# Altium schematic sheet 06_PWR_Inputs_12V.SchDoc
size 209 x 297 mm; DocumentNumber: Питание входов; SheetNumber: 7; SheetTotal: 11
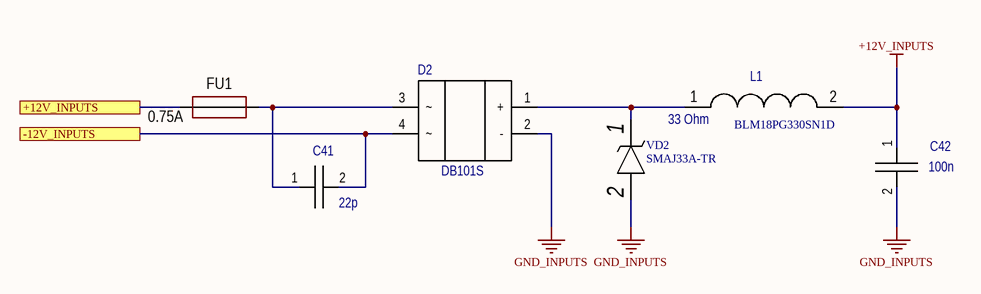
[diagram p0: 06_PWR_Inputs_12V.SchDoc]

## Parts
C41  value 22p  [C0603]  (hidden comment: C0603)
C42  value 100n  [C0603]  (hidden comment: C0603)
D2  DB101S  [DB-1S]
FU1  MaxCurrent: 0.75A  [FUSE: 1206]
L1  BLM18PG330SN1D  value 33 Ohm  [INDC1608N]
VD2  SMAJ33A-TR  [SM4T82AY]

## Ports
+12V_INPUTS, -12V_INPUTS

## Nets
+12V_INPUTS: C42.1 L1.2
GND_INPUTS: C42.2 D2.2(-) VD2.2(A)
+12V_INPUTS: FU1.1 ; port +12V_INPUTS  [a separate net that carries the same name]
-12V_INPUTS: C41.2 D2.4 ; port -12V_INPUTS
NetC41_1: C41.1 D2.3 FU1.2
NetD2_1: D2.1(+) L1.1 VD2.1(K)

## Notes on the sheet
- Подп. и дата
- Инв. № дубл.
- Взам. инв. №
- Инв. № подл.
- Изм.
- Лист
- № докум.
- Подп.
- Дата
- Форма 2а ГОСТ 2.104-2006
- Копировал
- Формат А4

## Library data of the parts
C41 = GRM1885C1H220JA01D: Manufacturer: Murata Manufacturing; Код: 80; ID: Конденсатор; Power/Voltage: 50V; Tolerance: ±5%; TKE: c0g; iii: Конденсатор GRM1885C1H220JA01D 22p 50V ±5% C0603 c0g Murata Manufacturing; Comments: C0603; Part Number: GRM1885C1H220JA01D; Package: C0603; TemperatureMin: -55; TemperatureMax: 125
C42 = GRM188R71E104KA01D: Manufacturer: Murata Manufacturing; Код: 23; ID: Конденсатор; Power/Voltage: 25V; Tolerance: ±10%; TKE: X7R; iii: Конденсатор GRM188R71E104KA01D 100n 25V ±10% C0603 X7R  Murata Manufacturing; Comments: C0603; Part Number: GRM188R71E104KA01D; Height: 0.9; Package: C0603; TemperatureMin: -55; TemperatureMax: 125
D2 = DB101S: SINGLE-PHASE SURFACE MOUNT BRIDGE RECTIFIER; Manufacturer: DC COMPONENTS; Код: 5; ID: Диодный мост; Value: 1A; Power/Voltage: 50V; iii: Диодный мост DB101S 1A 50V    DC COMPONENTS; Com: DB101S; Part Number: DB101S; ComponentLink1Description: Datasheet; ComponentLink1URL: \\server_altium\ServerShare\Schematic\pdf\DB101S.pdf; TemperatureMin: -55; TemperatureMax: 150
FU1 = Fuse: Manufacturer: 1206-13V-075A-1; VoltageMax: 13; Package: 1206; ValueManufacturerPartNumber: =TypeFuse+', '+VoltageMax+', '+MaxCurrent+', '+Package+', '+Temperature; PartNumber: 1206-13V-075A-1
L1 = BLM18PG330SN1D: Код: 22; ID: Ферритовая бусина; Power/Voltage: 3A; iii: Ферритовая бусина BLM18PG330SN1D 33 Ohm 3A  L0603; Com: BLM18PG330SN1D; Part Number: BLM18PG330SN1D; Package: L0603
VD2 = SMAJ33A-TR: TVS Diode (Uni-directional); Manufacturer_Name: STMicroelectronics; Datasheet Link: https://www.st.com/resource/en/datasheet/smaj10ca.pdf; Height: 2.65mm; PartNumber: SMAJ33A-TR; Mouser Part Number: 511-SMAJ33A-TR; Mouser Price/Stock: https://www.mouser.co.uk/ProductDetail/STMicroelectronics/SMAJ33A-TR?qs=jwZhmErakJAmVBO%2Fr9%252BXpg%3D%3D; Arrow Part Number: SMAJ33A-TR; Arrow Price/Stock: https://www.arrow.com/en/products/smaj33a-tr/stmicroelectronics?region=europe